# EasyEDA Pro project MasterDesignFileRev2.epro, board PCB1_1
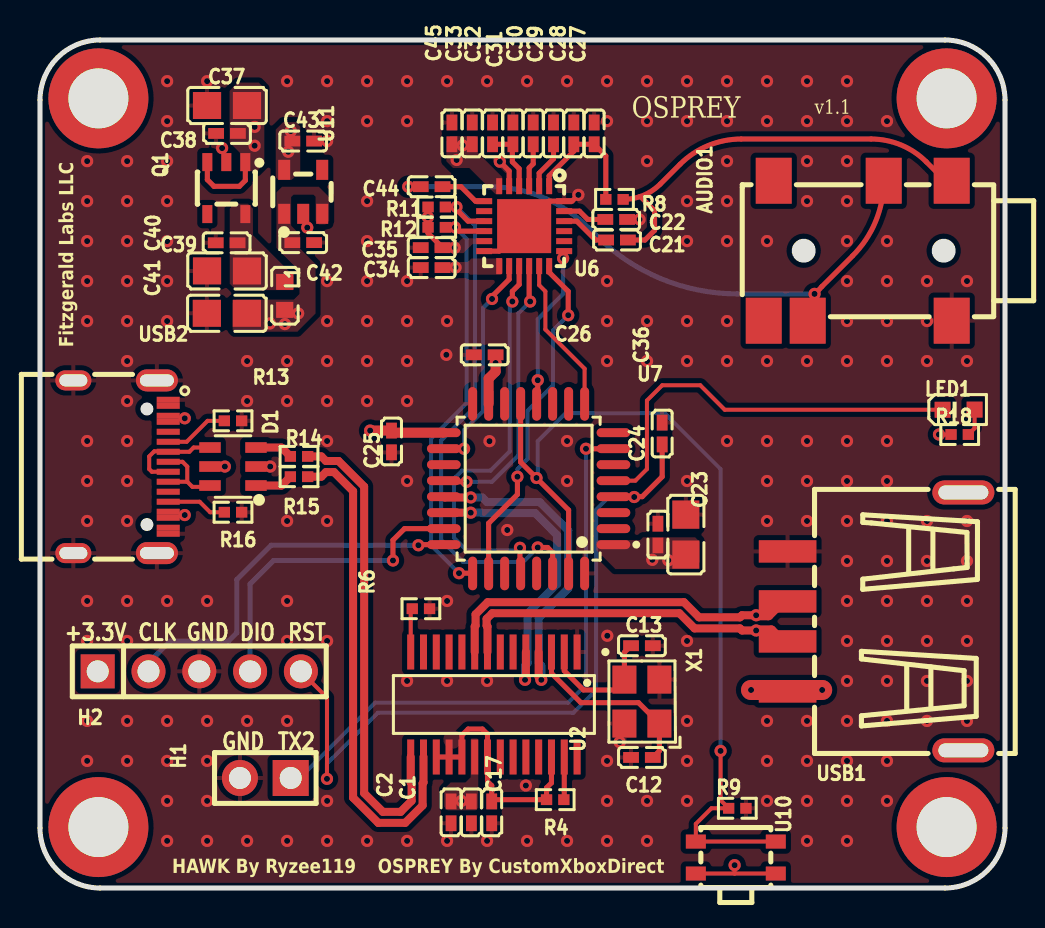
[diagram p2: board, top side]
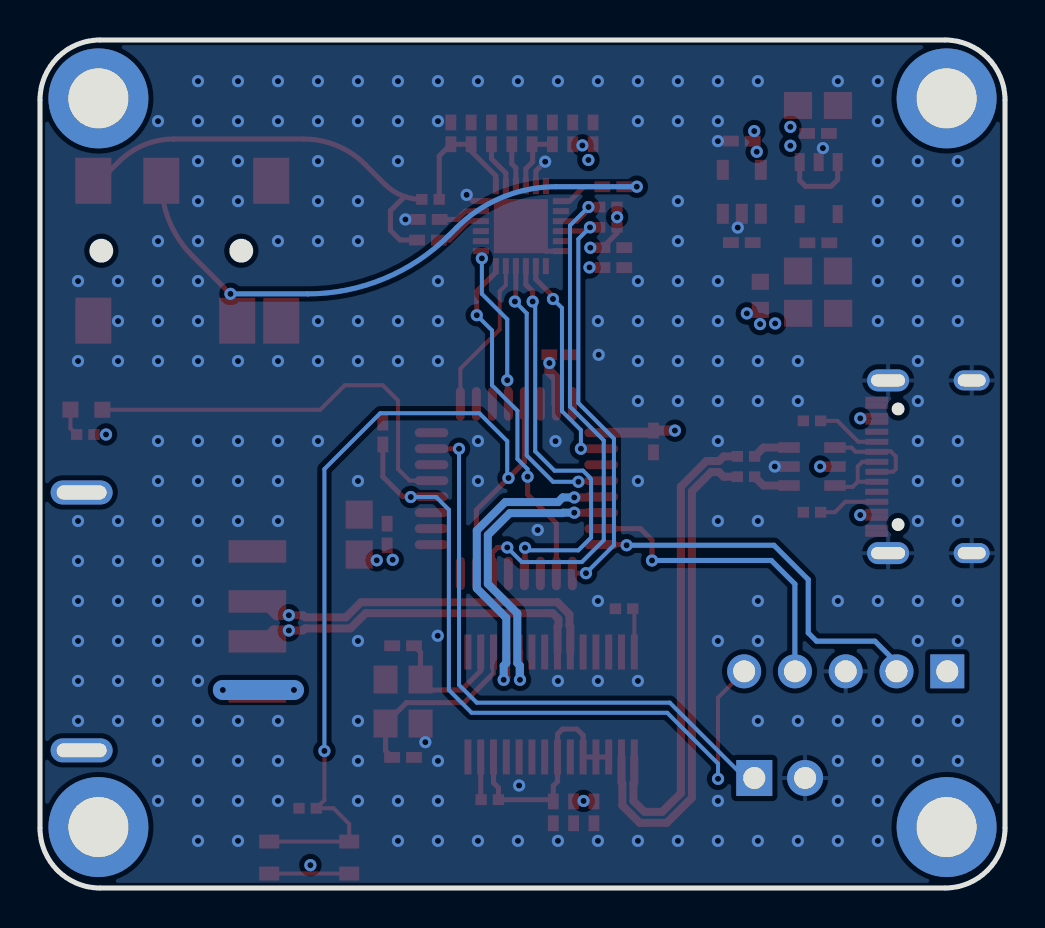
[diagram p3: board, bottom side, seen from below]

Outline 48.26 x 42.42 mm; copper layers: Top Layer, GND, PWR, Bottom Layer. Coordinates in mm from the lower left corner of the outline.
Outline path: 0,39.42 0,3 arc(0.88,0.88) 3,0 45.26,0 arc(47.38,0.88) 48.26,3 48.26,39.42 arc(47.38,41.54) 45.26,42.42 3,42.42 arc(0.88,41.54) 0,39.42
Stack: Top Layer 0.035mm Outer layer thickness 1oz / Dielectric1 0.2104mm 7628 RC49% 8.6mil / GND 0.0152mm Inner layer thickness / Dielectric2 1.065mm 1.1mm H/HOZ Copper / PWR 0.0152mm Inner layer thickness / Dielectric3 0.2104mm 7628 RC49% 8.6mil / Bottom Layer 0.035mm Outer layer thickness 1oz

## Design rules (mm)
template: Custom Config
spacing copperThickness1oz (default): track to track 0.102, other pairs 0.152 to 0.3
spacing copperThickness2oz: track to track 0.203, other pairs 0.152 to 0.3
track width copperThickness1oz (default): min 0.127, default 0.254, max 2.54
track width copperThickness2oz: min 0.203, default 0.254, max 2.54
differential pair differentialPair (default): width min 0.127, default 0.254, max 2.54; gap min 0.152, default 0.152
via viaSize (default): diameter min 0.5, default 0.61, max 10; hole min 0.3, default 0.305, max 6.3

## Placement (name value [footprint] x y rotation side)
AUDIO1  PJ-3420-A-SMT  [AUDIO-SMD_PJ-3420-A-SMT_C319102]  40.89 31.88 180 top
C1  100nF  [C0402]  21.57 3.78 90 top
C2  10uF  [C0402]  20.56 3.78 90 top
C12  15pF  [C0402]  30.1 6.53 180 top
C13  15pF  [C0402]  30.1 12.12 180 top
C17  10uF  [C0402]  22.59 3.78 90 top
C21  1uF  [C0402]  28.86 32.41 0 top
C22  1uF  [C0402]  28.82 33.44 0 top
C23  10uF  [C0805]  32.3 17.68 270 top
C24  100nF  [C0402]  30.9 17.68 270 top
C25  100nF  [C0402]  17.58 22.34 90 top
C26  100nF  [C0402]  22.24 26.67 0 top
C27  1uF  [C0402]  27.71 37.75 270 top
C28  1uF  [C0402]  26.7 37.75 270 top
C29  1uF  [C0402]  25.68 37.75 270 top
C30  1uF  [C0402]  24.67 37.75 270 top
C31  1uF  [C0402]  23.65 37.75 270 top
C32  1uF  [C0402]  22.63 37.75 270 top
C33  100nF  [C0402]  21.62 37.75 270 top
C34  1uF  [C0402]  19.59 31.03 0 top
C35  1uF  [C0402]  19.59 32.03 0 top
C36  100nF  [C0402]  31.12 22.73 270 top
C37  10uF  [C0805]  9.35 39.14 0 top
C38  100nF  [C0402]  9.35 37.74 0 top
C39  100nF  [C0402]  9.33 32.27 0 top
C40  10uF  [C0805]  9.35 30.87 0 top
C41  10uF  [C0805]  9.34 28.75 0 top
C42  100nF  [C0402]  13.16 32.28 180 top
C43  100nF  [C0402]  13.16 37.36 180 top
C44  10uF  [C0402]  19.59 35.08 180 top
C45  10uF  [C0402]  20.6 37.75 270 top
D1  USBLC6-2SC6  [SOT-23-6_L2.9-W1.6-P0.95-LS2.8-BL]  9.65 21.08 90 top
H1  -  [HDR-TH_2P-P2.54-V-M-1]  11.27 5.5 180 top
H2  -  [HDR-TH_5P-P2.54-V-M]  7.97 10.84 0 top
L1  MPZ1608S101ATAH0  [L0603]  12.24 29.62 270 top
LED1  XL-1608UGC-04  [LED0603-RD_GREEN]  45.94 23.93 0 top
NOREF  -  [Pad_e89]  2.92 3.05 0 top
NOREF#2  -  [Pad_e86]  45.34 39.5 0 top
NOREF#3  -  [Pad_e90]  2.92 39.5 0 top
NOREF#4  -  [Pad_e84]  45.34 3.05 0 top
Q1  XC6220B331MR-G  [SOT-25_L3.0-W1.6-P0.95-LS2.8-TL]  9.32 35.01 270 top
R4  NC  [R0402]  25.77 4.42 0 top
R6  2.7kΩ  [R0402]  19.05 13.97 180 top
R8  1.5kΩ  [R0402]  28.73 34.44 0 top
R9  1.5kΩ  [R0402]  34.87 3.99 0 top
R11  1.5kΩ  [R0402]  19.84 34.06 0 top
R12  1.5kΩ  [R0402]  19.84 33.05 0 top
R13  5.1kΩ  [R0402]  9.65 23.37 0 top
R14  0Ω  [R0402]  12.95 21.59 180 top
R15  0Ω  [R0402]  12.95 20.57 180 top
R16  5.1kΩ  [R0402]  9.65 18.8 0 top
R18  150Ω  [R0402]  45.99 22.68 180 top
U2  FE1.1S-BSOP28BCN  [SSOP-28_L9.9-W3.9-P0.64-LS6.0-BL-1]  22.7 9.18 180 top
U6  MAX9860ETG+T  [TQFN-24_L4.0-W4.0-P0.50-BL-EP]  24.21 33.11 180 top
U7  STM32G431K6T6  [LQFP-32_L7.0-W7.0-P0.80-LS9.0-BL]  24.44 19.98 90 top
U10  TSC4A 160gf-WZ 016  [KEY-SMD_TSC4A]  34.8 1.52 0 top
U11  XC6220B181MR  [SOT-23-5_L2.9-W1.6-P0.95-LS2.8-BR]  13.16 34.82 270 top
USB1  10.0 QHHTZB6.3  [USB-A-TH_10.0QHHTZB6.3]  41.78 13.33 90 top
USB2  USB-310-B-SU  [USB-C-SMD_20P-P0.50-L7.4-W8.9]  4.04 21.07 90 top
X1  12MHz  [OSC-SMD_4P-L3.2-W2.5-BL]  30.1 9.33 90 top

## Footprints (pads in the part's own frame, mm; a bottom-side part is the same pattern mirrored in y, then rotated)
AUDIO-SMD_PJ-3420-A-SMT_C319102
  rect 1.8x2.3 smd: 1(-4.7,-3.5) 2(-4.7,3.5) 3(-1.3,-3.5) 4(2.5,3.5) 5(4.7,3.5) 6(4.2,-3.5)
C0402
  rect 0.79x0.54 smd: 1(-0.545,0) 2(0.545,0)
C0805
  rect 1.41x1.35 smd: 1(-1,0) 2(1,0)
HDR-TH_2P-P2.54-V-M-1
  rect 1.8x1.8 hole 1.1: 1(-1.27,0)
  round 1.8 hole 1.1: 2(1.27,0)
HDR-TH_5P-P2.54-V-M
  rect 1.7x1.7 hole 1.1: 1(-5.08,0)
  round 1.7 hole 1.1: 2(-2.54,0) 3(0,0) 4(2.54,0) 5(5.08,0)
KEY-SMD_TSC4A
  rect 1x0.7 smd: 1(-2,0.8) 2(2,0.8) 3(-2,-0.8) 4(2,-0.8)
L0603
  rect 0.8x0.864 smd: 1(-0.7,0) 2(0.7,0)
LED0603-RD_GREEN
  rect 0.8x0.8 smd: 1(-0.799,-0.004) 2(0.799,0.004)
LQFP-32_L7.0-W7.0-P0.80-LS9.0-BL
  oval 0.448x1.684 smd: 1(-2.8,-4.242) 2(-2,-4.242) 3(-1.2,-4.242) 4(-0.4,-4.242) 5(0.4,-4.242) 6(1.2,-4.242) 7(2,-4.242) 8(2.8,-4.242) 17(2.8,4.242) 18(2,4.242) 19(1.2,4.242) 20(0.4,4.242) 21(-0.4,4.242) 22(-1.2,4.242) 23(-2,4.242) 24(-2.8,4.242)
  oval 1.684x0.448 smd: 9(4.242,-2.8) 10(4.242,-2) 11(4.242,-1.2) 12(4.242,-0.4) 13(4.242,0.4) 14(4.242,1.2) 15(4.242,2) 16(4.242,2.8) 25(-4.242,2.8) 26(-4.242,2) 27(-4.242,1.2) 28(-4.242,0.4) 29(-4.242,-0.4) 30(-4.242,-1.2) 31(-4.242,-2) 32(-4.242,-2.8)
OSC-SMD_4P-L3.2-W2.5-BL
  rect 1.4x1.2 smd: 1(-1.1,-0.875) 2(1.1,-0.875) 3(1.1,0.875) 4(-1.1,0.875)
Pad_e84
  round 5 hole 3: 1(0,0)
Pad_e86
  round 5 hole 3: 1(0,0)
Pad_e89
  round 5 hole 3: 1(0,0)
Pad_e90
  round 5 hole 3: 1(0,0)
R0402
  rect 0.566x0.54 smd: 1(-0.433,0) 2(0.433,0)
SOT-23-5_L2.9-W1.6-P0.95-LS2.8-BR
  rect 1x0.6 smd: 1(1.1,-0.95) 2(1.1,0) 3(1.1,0.95) 4(-1.1,0.95) 5(-1.1,-0.95)
SOT-23-6_L2.9-W1.6-P0.95-LS2.8-BL
  rect 0.532x1.072 smd: 1(-0.95,-1.149) 2(0,-1.149) 3(0.95,-1.149) 4(0.95,1.149) 5(0,1.149) 6(-0.95,1.149)
SOT-25_L3.0-W1.6-P0.95-LS2.8-TL
  rect 0.9x0.5 smd: 1(-1.3,0.95) 2(-1.3,0) 3(-1.3,-0.95) 4(1.3,-0.95) 5(1.3,0.95)
SSOP-28_L9.9-W3.9-P0.64-LS6.0-BL-1
  rect 0.35x1.751 smd: 1(-4.16,-2.626) 2(-3.52,-2.626) 3(-2.88,-2.626) 4(-2.24,-2.626) 5(-1.6,-2.626) 6(-0.96,-2.626) 7(-0.32,-2.626) 8(0.32,-2.626) 9(0.96,-2.626) 10(1.6,-2.626) 11(2.24,-2.626) 12(2.88,-2.626) 13(3.52,-2.626) 14(4.16,-2.626) 15(4.16,2.626) 16(3.52,2.626) 17(2.88,2.626) 18(2.24,2.626) 19(1.6,2.626) 20(0.96,2.626) 21(0.32,2.626) 22(-0.32,2.626) 23(-0.96,2.626) 24(-1.6,2.626) 25(-2.24,2.626) 26(-2.88,2.626) 27(-3.52,2.626) 28(-4.16,2.626)
TQFN-24_L4.0-W4.0-P0.50-BL-EP
  rect 0.3x0.8 smd: 1(-1.25,-2) 2(-0.75,-2) 3(-0.25,-2) 4(0.25,-2) 5(0.75,-2) 6(1.25,-2) 13(1.25,2) 14(0.75,2) 15(0.25,2) 16(-0.25,2) 17(-0.75,2) 18(-1.25,2)
  rect 0.8x0.3 smd: 7(2,-1.25) 8(2,-0.75) 9(2,-0.25) 10(2,0.25) 11(2,0.75) 12(2,1.25) 19(-2,1.25) 20(-2,0.75) 21(-2,0.25) 22(-2,-0.25) 23(-2,-0.75) 24(-2,-1.25)
  rect 2.7x2.7 smd: 25(0,0)
USB-A-TH_10.0QHHTZB6.3
  rect 1.12x2.88 smd: 1(-3.5,4.395) 2(-1,4.395) 3(1,4.395) 4(3.5,4.395)
  oval 1.2x3.1 hole 0.7x2.5: 5(-6.45,-4.395) 6(6.45,-4.395)
USB-C-SMD_20P-P0.50-L7.4-W8.9
  oval 1x1.8 hole 0.6x1.4: 0(-4.32,2.373) 0(4.32,2.373)
  oval 1.1x2.1 hole 0.6x1.7: 0(-4.32,-1.807) 0(4.32,-1.807)
  rect 0.3x1.15 smd: A1(3.35,-2.372) A4(2.55,-2.372) A5(1.25,-2.373) A6(0.249,-2.373) A7(-0.25,-2.372) A8(-1.25,-2.373) A9(-2.55,-2.373) A12(-3.35,-2.373) B1(-3.05,-2.373) B4(-2.251,-2.373) B5(-1.75,-2.373) B6(-0.75,-2.373) B7(0.75,-2.372) B8(1.75,-2.373) B9(2.251,-2.372) B12(3.05,-2.372)

## Nets
As in the schematic.

Pads without a net: AUDIO1 5 6; NOREF 1; NOREF#2 1; NOREF#3 1; NOREF#4 1; Q1 4; U2 6 7 10 11 12 13 22 23 24 25 28; U6 8 20 21; U7 2 3; U11 4; USB1 5 6; USB2 A8 B8

## Via types
v1: diameter 0.61, hole 0.305, Top Layer to Bottom Layer, 272 vias

## Routing (per net, layer and track width the routed paths; a pad name or vN(x,y) marks a point on that pad's centre or on a via; arc(x,y) is an arc through that point)
+1.8V: length 18.7
  PWR w1: v1(20.84,36.42) 20.55,36.7 16.38,36.7 15.37,35.69 13.34,35.69 12.54,36.48 v1(12.54,37.86) ; v1(20.84,36.42) 21.24,36.42 22.35,35.31 22.35,31.88 21.52,31.04 v1(20.78,31.04) ; v1(20.84,36.42) 21.14,36.72 v1(21.14,37.15)
  vias: v1(12.42,36.83)
+3.3V: length 13.7
  Top Layer w0.2: 34.74,0.72 v1(34.74,1.14) ; 34.74,0.72 U10.3 ; 34.74,0.72 U10.4 ; R18.2 v1(44.96,22.68)
  Top Layer w0.254: C35.2 19.41,32.76 R12.1 R11.1
  Top Layer w0.5: v1(16.51,22.88) C25.2 17.68,22.78 U7.17 ; C26.2 v1(22.79,26.26) 22.79,25.83 22.44,25.48 U7.15
  vias: v1(11.5,28.24) v1(12.25,28.21) v1(12.91,28.74) v1(19.4,33.55) v1(20.74,32.03) v1(30.62,16.42) v1(31.42,16.39)
GND: length 7.3
  Top Layer w0.254: U6.12 22.96,31.86 U6.25 25.46,34.36 U6.24 26.61,34.36 v1(26.92,34.67) ; U6.5 23.46,35.86 v1(23,36.33)
  vias: v1(2.36,36.36) v1(2.36,34.36) v1(2.36,32.36) v1(2.36,30.36) v1(2.36,28.36) v1(2.36,22.36) v1(2.36,20.36) v1(2.36,18.36) v1(2.36,14.36) v1(2.36,12.36) v1(2.36,8.36) v1(2.36,6.36) v1(4.36,36.36) v1(4.36,34.36) v1(4.36,32.36) v1(4.36,30.36) v1(4.36,28.36) v1(4.36,26.36) v1(4.36,24.36) v1(4.36,22.36) v1(4.36,20.36) v1(4.36,18.36) v1(4.36,14.36) v1(4.36,12.36) v1(4.36,8.36) v1(4.36,6.36) v1(6.36,40.36) v1(6.36,38.36) v1(6.36,36.36) v1(6.36,34.36) v1(6.36,32.36) v1(6.36,30.36) v1(6.36,28.36) v1(6.36,14.36) v1(6.36,8.36) v1(6.36,6.36) v1(6.36,4.36) v1(6.36,2.36) v1(8.36,40.36) v1(8.36,14.36) v1(8.36,8.36) v1(8.36,6.36) v1(8.36,4.36) v1(8.36,2.36) v1(9.11,37.01) v1(10.36,26.36) v1(10.36,24.36) v1(10.36,8.36) v1(10.36,2.36) v1(11.51,21.08) v1(12.36,40.36) v1(12.36,26.36) v1(12.36,24.36) v1(12.36,18.36) v1(12.36,14.36) v1(12.36,12.36) v1(12.36,8.36) v1(12.36,2.36) v1(13.37,33.03) v1(14.36,40.36) v1(14.36,38.36) v1(14.36,37.36) v1(14.36,30.36) v1(14.36,28.36) v1(14.36,26.36) v1(14.36,24.36) v1(14.36,22.36) v1(14.36,18.36) v1(14.36,12.36) v1(14.36,4.36) v1(14.36,2.36) v1(16.36,40.36) v1(16.36,38.36) v1(16.36,34.36) v1(16.36,32.36) v1(16.36,30.36) v1(16.36,28.36) v1(16.36,26.36) v1(16.36,24.36) v1(16.36,2.36) v1(18.36,40.36) v1(18.36,38.36) v1(18.36,30.36) v1(18.36,28.36) v1(18.36,26.36) v1(18.36,24.36) v1(18.36,20.36) v1(18.36,10.36) v1(18.36,2.36) v1(20.36,40.36) v1(20.36,28.36) v1(20.32,26.67) v1(20.36,14.36) v1(20.36,10.36) v1(20.36,2.36) v1(22.36,40.36) v1(22.36,10.36) v1(22.36,2.36) v1(22.48,22.35) v1(23.37,17.91) v1(24.36,40.36) v1(24.3,5.13) v1(24.36,2.36) v1(26.36,40.36) v1(26.36,22.36) v1(26.36,20.36) v1(26.36,2.36) v1(28.36,40.36) v1(28.36,38.36) v1(28.36,30.36) v1(28.36,28.36) v1(28.36,26.36) v1(28.36,6.36) v1(28.36,4.36) v1(28.36,2.36) v1(28.37,12.62) v1(28.99,7.3) v1(29.98,33.44) v1(30.36,40.36) v1(30.36,38.36) v1(30.36,36.36) v1(30.36,28.36) v1(30.36,26.36) v1(30.36,4.36) v1(30.36,2.36) v1(32.36,40.36) v1(32.36,38.36) v1(32.36,34.36) v1(32.36,32.36) v1(32.36,28.36) v1(32.36,26.36) v1(32.36,20.36) v1(32.36,12.36) v1(32.36,8.36) v1(32.36,6.36) v1(32.36,4.36) v1(34.36,40.36) v1(34.36,38.36) v1(34.36,36.36) v1(34.36,34.36) v1(34.36,32.36) v1(34.36,28.36) v1(34.36,26.36) v1(34.36,22.36) v1(36.36,40.36) v1(36.36,38.36) v1(36.36,32.36) v1(36.36,26.36) v1(36.36,22.36) v1(36.36,20.36) v1(36.36,18.36) v1(36.36,8.36) v1(36.36,6.36) v1(36.36,4.36) v1(38.36,40.36) v1(38.36,38.36) v1(38.36,36.36) v1(38.36,34.36) v1(38.36,26.36) v1(38.36,22.36) v1(38.36,20.36) v1(38.36,18.36) v1(38.36,8.36) v1(38.36,6.36) v1(38.36,4.36) v1(38.36,2.36) v1(40.36,40.36) v1(40.36,38.36) v1(40.36,36.36) v1(40.36,34.36) v1(40.36,32.36) v1(40.36,30.36) v1(40.36,28.36) v1(40.36,26.36) v1(40.36,22.36) v1(40.36,20.36) v1(40.36,18.36) v1(40.36,16.36) v1(40.36,14.36) v1(40.36,12.36) v1(40.36,10.36) v1(40.36,8.36) v1(40.36,6.36) v1(40.36,4.36) v1(40.36,2.36) v1(42.36,38.36) v1(42.36,32.36) v1(42.36,30.36) v1(42.36,28.36) v1(42.36,26.36) v1(42.36,22.36) v1(42.36,20.36) v1(42.36,18.36) v1(42.36,16.36) v1(42.36,14.36) v1(42.36,12.36) v1(42.36,10.36) v1(42.36,8.36) v1(42.36,6.36) v1(42.36,4.36) v1(44.36,30.36) v1(44.36,28.36) v1(44.36,26.36) v1(44.36,18.36) v1(44.36,16.36) v1(44.36,14.36) v1(44.36,12.36) v1(44.36,10.36) v1(44.36,8.36) v1(46.36,30.36) v1(46.36,26.36) v1(46.36,18.36) v1(46.36,16.36) v1(46.36,14.36) v1(46.36,12.36) v1(46.36,10.36) v1(46.36,8.36)
VBUS: length 77.5
  Top Layer w0.254: Q1.1 10.27,35.39 9.97,35.1 8.7,35.1 8.37,35.43 Q1.3
  Top Layer w1: v1(35.56,9.91) v1(39.12,9.91)
  PWR w1: v1(9.25,21.08) 7.25,21.08 7.24,21.09 ; 7.24,21.09 v1(7.24,23.5) 8.38,24.64 8.38,32.89 10.73,35.25 v1(10.73,37.13) v1(10.73,38.07) ; 7.24,21.09 v1(7.24,18.66)
  PWR w1.2: v1(7.24,18.66) 9.89,16 13.59,16 16.76,12.83 16.76,6.86 19.27,4.36 v1(21.08,4.36) 21.75,4.36 27.31,9.91 v1(35.56,9.91) v1(39.12,9.91)
  Bottom Layer w1: v1(39.12,9.91) v1(35.56,9.91)
A_D+: length 18.4
  Top Layer w0.4: v1(35.81,13.64) 35.11,13.64 35,13.54 32.96,13.54 32.2,14.3 22.39,14.3 21.78,13.69 21.78,13.12 21.74,13.08 U2.9
  Top Layer w0.5: v1(35.81,13.64) 36.43,13.64 37.12,14.33 USB1.3
A_D-: length 17.4
  Top Layer w0.4: v1(35.81,12.88) 35.11,12.88 35,12.99 32.73,12.99 31.97,13.75 22.62,13.75 22.34,13.46 22.34,13.12 22.38,13.08 U2.8
  Top Layer w0.5: USB1.2 37.12,12.33 36.57,12.88 v1(35.81,12.88)
D+: length 24.9
  Top Layer w0.4: R15.1 14.07,20.57 14.3,20.81 14.7,20.81 15.66,19.85 15.66,4.52 16.92,3.26 18.26,3.26 19.13,4.13 19.13,5.23 19.18,5.28 U2.16
D-: length 24
  Top Layer w0.4: U2.15 18.54,5.28 18.58,5.23 18.58,4.36 18.03,3.81 17.15,3.81 16.21,4.74 16.21,20.08 14.93,21.36 14.3,21.36 14.07,21.59 R14.1
NRST: length 37.3
  Top Layer w0.2: H2.5 13.05,10.83 14.35,9.53 v1(14.35,5.46)
  Top Layer w0.254: C36.2 31.12,20.57 30.12,19.58 U7.4
  Bottom Layer w0.2: v1(14.35,5.46) 14.35,6.22 16.89,8.76 26.67,8.76 27.81,9.91 27.81,18.92 28.45,19.56 v1(29.72,19.56)
PA0: length 21
  Top Layer w0.2: LED1.1 34.24,23.92 33.02,25.15 31.12,25.15 30.35,24.38 30.35,20.95 29.77,20.38 U7.5
PA2: length 29.9
  Top Layer w0.254: v1(27.31,21.97) 28.67,21.97 U7.7
  Bottom Layer w0.2: v1(27.31,21.97) 27.31,10.16 26.42,9.27 16.76,9.27 13,5.5 H1.1
PA4: length 7.8
  Top Layer w0.2: U6.17 24.96,30.16 25.27,29.84 25.27,27.94 27.24,25.98 U7.9
PA7: length 8.2
  Top Layer w0.2: v1(26.16,31.5) 26.16,31.81 U6.19
  Top Layer w0.254: v1(24.89,25.4) 24.89,24.27 U7.12
  Bottom Layer w0.2: v1(26.16,31.5) 26.16,29.72 24.89,28.45 v1(24.89,25.4)
PA8: length 11.1
  Top Layer w0.2: v1(21.21,21.97) 20.2,21.97 U7.18
  Top Layer w0.254: v1(22.61,29.46) 22.61,29.59 23.46,30.45 U6.14
  Bottom Layer w0.2: v1(21.21,21.97) 21.21,22.91 22.16,23.85 22.16,29.01 v1(22.61,29.46)
PA10: length 14
  Top Layer w0.254: U6.16 24.46,29.39 v1(24.51,29.34) ; v1(21.34,20.32) 20.25,20.32 U7.20
  Bottom Layer w0.2: v1(24.51,29.34) 23.92,28.75 23.92,21.63 22.61,20.32 v1(21.34,20.32)
PA11: length 16.5
  Top Layer w0.4: U2.4 24.94,10.55 v1(25.07,10.41) ; U7.21 20.23,19.54 v1(21.54,19.54)
  Bottom Layer w0.4: v1(21.54,19.54) 22.12,19.54 22.35,19.3 24.99,19.3 26.42,17.88 26.42,14.99 24.94,13.51 24.94,11.25 25.07,11.12 v1(25.07,10.41)
PA12: length 15.4
  Top Layer w0.4: U2.5 24.3,10.46 v1(24.26,10.41) ; v1(21.54,18.77) 20.2,18.77 U7.22
  Bottom Layer w0.4: v1(21.54,18.77) 22.1,18.77 22.12,18.75 24.77,18.75 25.86,17.65 25.86,15.21 24.39,13.74 24.39,11.25 24.26,11.12 v1(24.26,10.41)
PA13: length 15.8
  Top Layer w0.254: v1(17.65,16.38) 17.65,17.4 18.23,17.98 U7.23
  Bottom Layer w0.254: v1(17.65,16.38) 11.68,16.38 10.51,15.21 H2.4
PA14: length 19.2
  Top Layer w0.254: U7.24 18.95,17.18 v1(18.92,17.14)
  Bottom Layer w0.254: v1(18.92,17.14) 11.56,17.14 9.84,15.43 9.84,12.76 9.43,12.35 6.5,12.35 5.43,11.27 H2.2
PA15: length 21.6
  Top Layer w0.254: v1(20.96,15.75) 21.62,15.75 U7.25 ; U6.10 20.94,32.86 v1(20.75,33.05) 20.27,33.05
  Bottom Layer w0.2: v1(20.75,33.05) 21.34,32.46 21.34,24.26 19.56,22.48 19.56,17.14 v1(20.96,15.75)
PB3: length 17.4
  Top Layer w0.254: U7.26 22.44,18.25 23.88,19.69 v1(23.88,20.57) ; v1(26.42,28.65) 26.42,29.84 25.46,30.8 U6.18
  Bottom Layer w0.2: v1(26.42,28.65) 25.65,27.89 25.65,25.15 24.38,23.88 24.38,21.46 23.88,20.95 v1(23.88,20.57)
PB5: length 20.7
  Top Layer w0.254: v1(23.62,29.34) 23.62,29.84 23.96,30.19 U6.15 ; U7.28 24,15.77 v1(24,17.02)
  Bottom Layer w0.2: v1(23.62,29.34) 23.5,29.21 23.5,21.84 22.53,20.88 21.11,20.88 20.78,20.55 20.78,20.53 20.7,20.45 20.7,17.53 21.34,16.89 23.88,16.89 v1(24,17.02)
PB7: length 27.5
  Top Layer w0.254: 20.27,34.06 v1(20.83,34.06) 20.83,33.94 21.41,33.36 U6.9 ; U7.30 25.64,16.78 25.38,17.03 v1(24.89,17.03)
  Bottom Layer w0.2: v1(20.83,34.06) 21.76,33.14 21.76,24.08 20.07,22.39 20.07,17.4 21.16,16.31 24.16,16.31 v1(24.89,17.03)
$1N1326: length 6.4
  Top Layer w0.254: C13.2 29.23,11.79 X1.3 28.71,9.91 27.18,9.91 26.22,10.86 U2.2
$1N1327: length 9.3
  Top Layer w0.254: U2.3 25.58,10.74 27.05,9.27 29.93,9.27 30.98,8.22 30.98,6.86 C12.1
$1N1330: length 2.2
  Top Layer w0.2: R6.2 18.54,13.89 U2.14
$1N1333: length 12.3
  Top Layer w0.254: U2.17 U2.18 U2.19 21.1,7.64 21.41,7.95 22.12,7.95 22.38,7.7 U2.21 22.38,5.33 22.59,5.12 C17.2 22.68,4.42 R4.1 25.33,5.01 25.58,5.26 U2.26
$1N1341: length 2.1
  Top Layer w0.254: R4.2 26.22,4.44 U2.27
$1N8823: length 3
  Top Layer w0.2: USB2.B5 7.98,19.32 8.51,18.8 R16.1
$1N8824: length 4
  Top Layer w0.2: D1.6 8.44,20.07 7.62,20.07 7.36,20.32 USB2.B6 ; USB2.A6 7.13,21.32 7.37,21.08 7.37,20.32
$1N8825: length 4.9
  Top Layer w0.2: D1.4 7.68,22.03 7.47,21.82 USB2.B7 6.39,21.84 5.72,21.84 5.46,21.59 5.46,20.95 5.6,20.82 USB2.A7
$1N8826: length 3.2
  Top Layer w0.2: R13.1 8.38,23.37 7.33,22.32 USB2.A5
$1N8828: length 1.9
  Top Layer w0.4: D1.3 12.08,22.03 R14.2
$1N8829: length 1.9
  Top Layer w0.4: R15.2 12.08,20.13 D1.1
$1N10211: length 3.3
  Top Layer w0.254: C32.2 C31.2 23.62,37.17 23.62,36.32 23.96,35.98 U6.4
$1N10390: length 6.6
  Top Layer w0.254: R8.1 28.3,36.62 C27.2 C28.2 26.7,36.86 25.46,35.62 U6.1
$1N10572: length 2.4
  Top Layer w0.254: C29.2 25.68,36.48 24.96,35.76 U6.2
$1N10576: length 2.2
  Top Layer w0.254: U6.3 24.46,36.02 24.67,36.22 C30.2
$1N10655: length 2.2
  Top Layer w0.254: C22.1 27.39,33.44 26.98,33.86 U6.23
$1N10660: length 2.5
  Top Layer w0.254: C21.1 27.79,32.41 26.84,33.36 U6.22
$1N10709: length 21.6
  Top Layer w0.254: C21.2 30.25,32.41 30.73,32.89 30.73,33.88 30.03,34.59 ; 30.03,34.59 arc(29.6,34.48) R8.2 ; 30.03,34.59 arc(30.56,34.85) 31.03,35.22 32,36.19 arc(33.41,37.13) 35.07,37.47 41.56,37.47 arc(43.06,37.17) 44.32,36.32 45.04,35.61 arc(45.29,35.44) AUDIO1.1
$1N10766: length 2.4
  Top Layer w0.254: U6.7 21.78,34.36 21.05,35.08 C44.1
$1N10774: length 30.7
  Top Layer w0.254: C44.2 v1(18.41,35.08) ; AUDIO1.4 arc(38.49,29.06) 38.78,29.69 arc(38.93,29.89) 39.1,30.08 40.64,31.62 arc(41.79,33.34) 42.19,35.37
  Bottom Layer w0.254: v1(38.74,29.72) 34.88,29.72 arc(31.05,30.48) 27.81,32.65 27.43,33.02 arc(25.15,34.54) 22.46,35.08 v1(18.41,35.08)
$1N11459: length 46.2
  Top Layer w0.2: U10.2 U10.1 32.8,3.21 33.58,3.99 34.44,3.99 34.04,4.39 v1(34.04,6.86)
  Top Layer w0.254: U7.31 26.44,18.9 v1(24.83,20.51) 24.04,21.3 U7.13
  Bottom Layer w0.2: v1(24.83,20.51) 24.89,20.57 24.89,22.35 26.29,23.75 31.24,23.75 34.04,20.95 v1(34.04,6.86)
$1N17270: length 1.4
  Top Layer w0.2: R18.1 46.74,23 LED1.2

## Copper pours and planes (outline as drawn; the poured copper is in the pictures)
+1.8V on Top Layer: 19.73,31.49 23.13,31.49 23.13,30.68 19.73,30.68
+1.8V on Top Layer: 20.32,37.61 23.11,37.61 23.11,34.71 20.32,34.71
+1.8V on Top Layer: 11.79,38.31 13.01,38.31 13.01,35.42 11.79,35.42
+3.3V on Top Layer: 27.81,17.54 32.99,17.54 32.99,15.95 27.81,15.95
+3.3V on Top Layer: 9.63,35.08 14.46,35.08 14.46,27.83 9.63,27.83
+3.3V on Top Layer: 19.72,32.5 22.61,32.5 22.61,31.76 19.72,31.76
+3.3V on PWR: 0,39.42 0.01,39.68 0.06,40.02 0.15,40.36 0.28,40.69 0.45,40.99 0.65,41.28 0.88,41.54 1.14,41.77 1.43,41.97 1.73,42.14 2.06,42.27 2.39,42.36 2.74,42.41 3,42.42 45.26,42.42 45.52,42.41 45.87,42.36 46.2,42.27 46.53,42.14 46.83,41.97 47.12,41.77 47.38,41.54 47.61,41.28 47.81,40.99 47.98,40.69 48.11,40.36 48.2,40.02 48.25,39.68 48.26,39.42 48.26,3 48.25,2.74 48.2,2.39 48.11,2.06 47.98,1.73 47.81,1.43 47.61,1.14 47.38,0.88 47.12,0.65 46.83,0.45 46.53,0.28 46.2,0.15 45.87,0.06 45.52,0.01 45.26,0 3,0 2.74,0.01 2.39,0.06 2.06,0.15 1.73,0.28 1.43,0.45 1.14,0.65 0.88,0.88 0.65,1.14 0.45,1.43 0.28,1.73 0.15,2.06 0.06,2.39 0.01,2.74 0,3
GND on Top Layer: 0,39.42 0.01,39.68 0.06,40.02 0.15,40.36 0.28,40.69 0.45,40.99 0.65,41.28 0.88,41.54 1.14,41.77 1.43,41.97 1.73,42.14 2.06,42.27 2.39,42.36 2.74,42.41 3,42.42 45.26,42.42 45.52,42.41 45.87,42.36 46.2,42.27 46.53,42.14 46.83,41.97 47.12,41.77 47.38,41.54 47.61,41.28 47.81,40.99 47.98,40.69 48.11,40.36 48.2,40.02 48.25,39.68 48.26,39.42 48.26,3 48.25,2.74 48.2,2.39 48.11,2.06 47.98,1.73 47.81,1.43 47.61,1.14 47.38,0.88 47.12,0.65 46.83,0.45 46.53,0.28 46.2,0.15 45.87,0.06 45.52,0.01 45.26,0 3,0 2.74,0.01 2.39,0.06 2.06,0.15 1.73,0.28 1.43,0.45 1.14,0.65 0.88,0.88 0.65,1.14 0.45,1.43 0.28,1.73 0.15,2.06 0.06,2.39 0.01,2.74 0,3
GND on Bottom Layer: 0,39.42 0.01,39.68 0.06,40.02 0.15,40.36 0.28,40.69 0.45,40.99 0.65,41.28 0.88,41.54 1.14,41.77 1.43,41.97 1.73,42.14 2.06,42.27 2.39,42.36 2.74,42.41 3,42.42 45.26,42.42 45.52,42.41 45.87,42.36 46.2,42.27 46.53,42.14 46.83,41.97 47.12,41.77 47.38,41.54 47.61,41.28 47.81,40.99 47.98,40.69 48.11,40.36 48.2,40.02 48.25,39.68 48.26,39.42 48.26,3 48.25,2.74 48.2,2.39 48.11,2.06 47.98,1.73 47.81,1.43 47.61,1.14 47.38,0.88 47.12,0.65 46.83,0.45 46.53,0.28 46.2,0.15 45.87,0.06 45.52,0.01 45.26,0 3,0 2.74,0.01 2.39,0.06 2.06,0.15 1.73,0.28 1.43,0.45 1.14,0.65 0.88,0.88 0.65,1.14 0.45,1.43 0.28,1.73 0.15,2.06 0.06,2.39 0.01,2.74 0,3
GND on GND: 0.26,42.16 48,42.16 48,0.26 0.26,0.26
VBUS on Top Layer: 9.48,40.29 11.22,40.29 11.22,35.86 9.48,35.86
VBUS on Top Layer: 20.21,7.48 21.92,7.48 21.92,3.89 20.21,3.89
$1N9520 on Top Layer: 9.49,34.23 12.68,34.23 12.68,29.91 9.49,29.91

Small or netless copper shapes (teardrops, artwork), in the pictures only: 24 on GND

## Text on the board
Top Silkscreen Layer: +3.3V | CLK | GND | DIO | RST | TX2 | v1.1 | OSPREY | HAWK By Ryzee119 | OSPREY By CustomXboxDirect | Fitzgerald Labs LLC
